# EAGLE schematic Escorna_Shield_botoneira_2_0B (EAGLE 6.4)
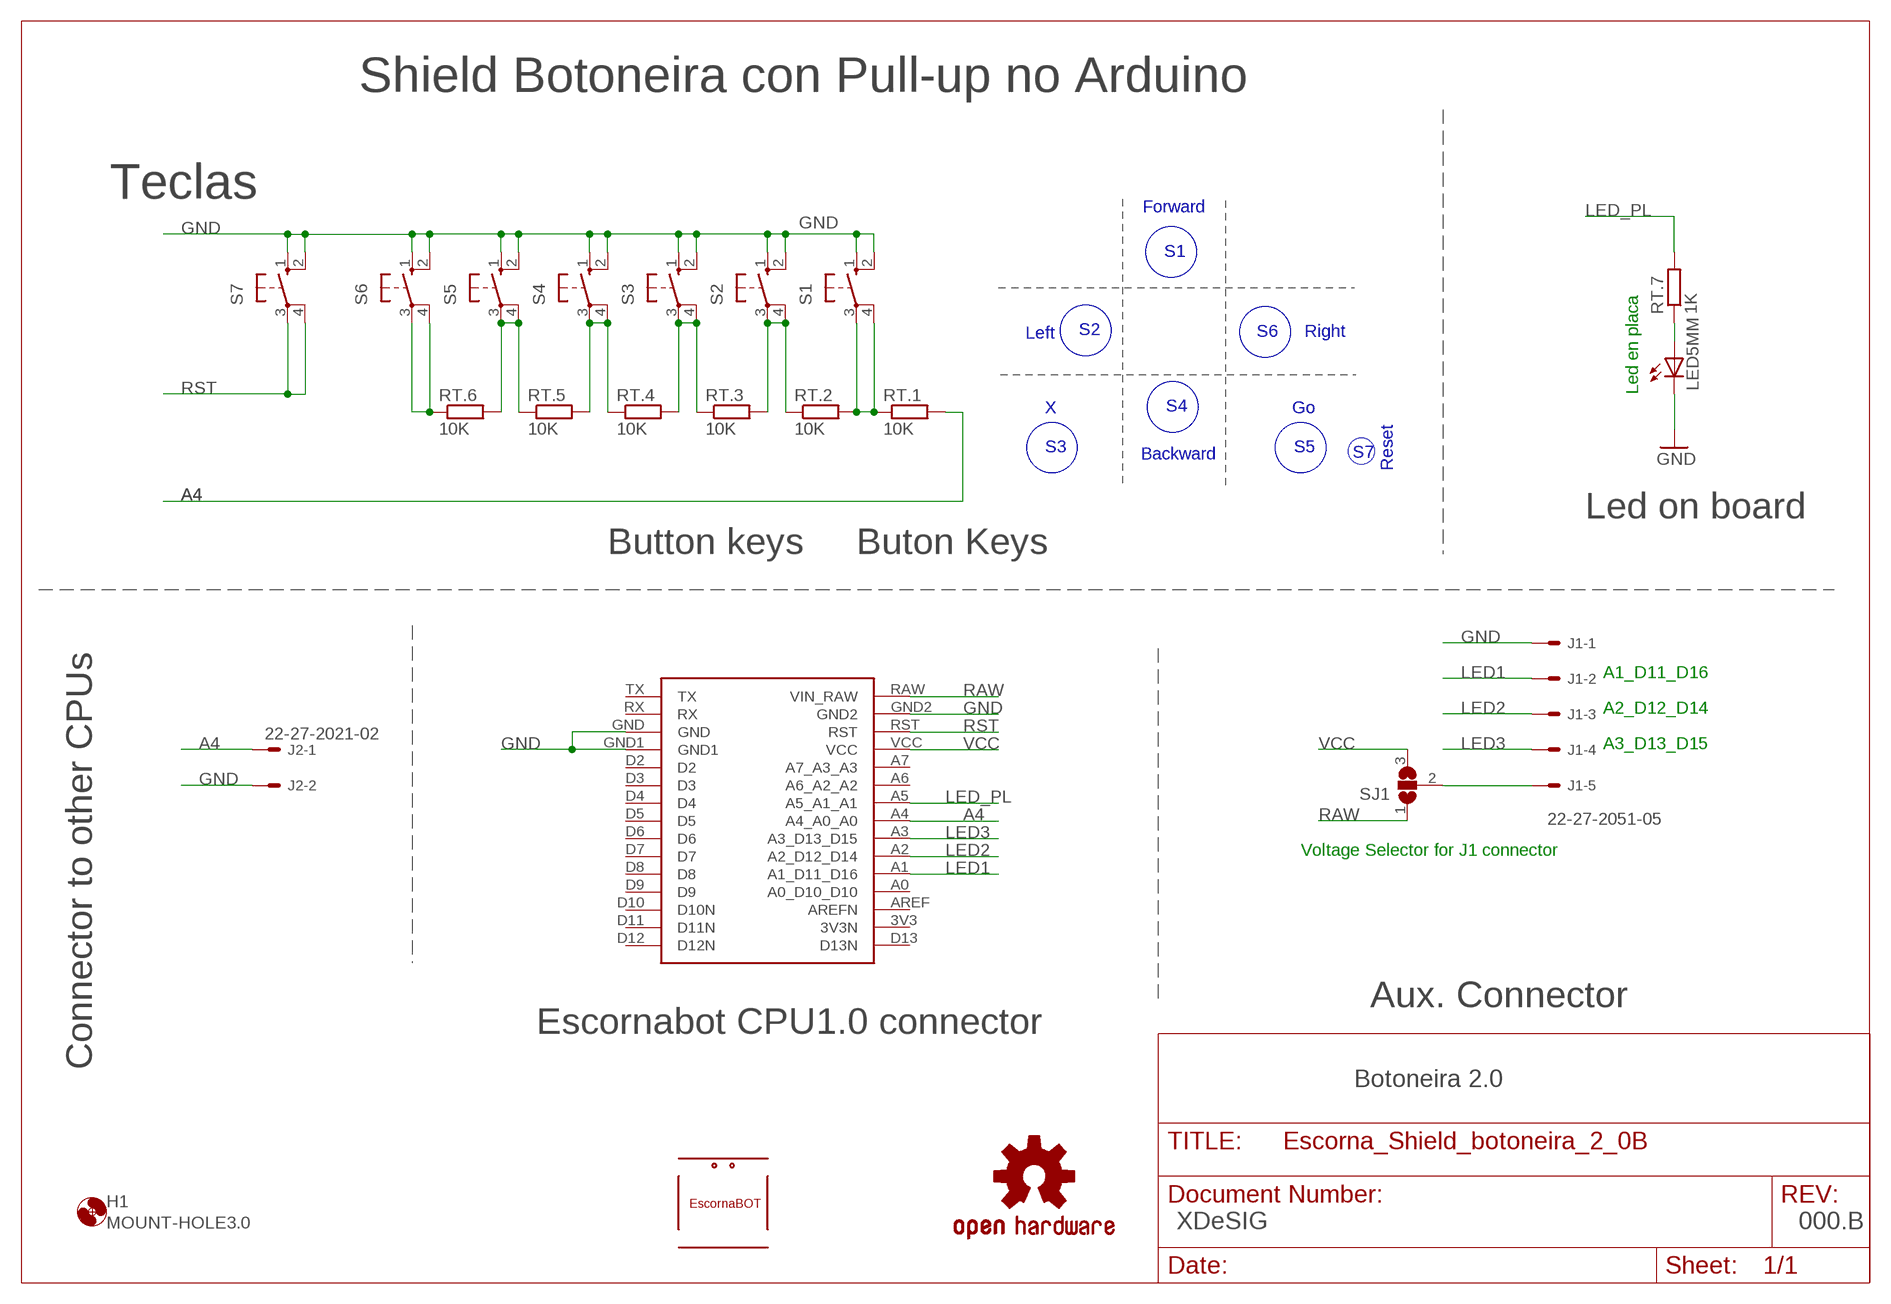
[diagram p0: schematic, sheet 1]

## Parts
ESSH1  OUTL_ESCORNASHILED  [OUTL_ESCORNASHIELD]
H1  MOUNT-HOLE3.0  [3,0]
J1  22-27-2051-05  [6410-05]
J2  22-27-2021-02  [6410-02]
LED5MM  LED5MM  [LED5MM]
LOGO2  OSHW-LOGOS  [OSHW-LOGO-S]
RT.1  10K  R-EU_0204/7  [0204/7]
RT.2  10K  R-EU_0204/7  [0204/7]
RT.3  10K  R-EU_0204/7  [0204/7]
RT.4  10K  R-EU_0204/7  [0204/7]
RT.5  10K  R-EU_0204/7  [0204/7]
RT.6  10K  R-EU_0204/7  [0204/7]
RT.7  1K  R-EU_0204/7  [0204/7]
S1  B3F-40XX  40-XX  [B3F40XX_NH]
S2  B3F-40XX  40-XX  [B3F40XX_NH]
S3  B3F-40XX  40-XX  [B3F40XX_NH]
S4  B3F-40XX  40-XX  [B3F40XX_NH]
S5  B3F-40XX  40-XX  [B3F40XX_NH]
S6  B3F-40XX  40-XX  [B3F40XX_NH]
S7  10-XX  [B3F-10XX]
SJ1  SOLDERJUMPER_2WAY  [SJ_2]
U$1  ESCORNABOT  [ESCORNA_PEQUE]

## Nets
A4: ESSH1.A4(A4_A0_A0) J2.1 RT.1.2
GND: ESSH1.GND ESSH1.GND1 ESSH1.GND2 J1.1 J2.2 LED5MM.K(C) S1.1(S) S1.2(S1) S2.1(S) S2.2(S1) S3.1(S) S3.2(S1) S4.1(S) S4.2(S1) S5.1(S) S5.2(S1) S6.1(S) S6.2(S1) S7.1(S) S7.2(S1)
LED1: ESSH1.A1(A1_D11_D16) J1.2
LED2: ESSH1.A2(A2_D12_D14) J1.3
LED3: ESSH1.A3(A3_D13_D15) J1.4
LED_PL: ESSH1.A5(A5_A1_A1) RT.7.2
N$1: LED5MM.A RT.7.1
N$2: J1.5 SJ1.2
N$6: RT.6.1 S6.3(P) S6.4(P1)
N$7: RT.1.1 RT.2.2 S1.3(P) S1.4(P1)
N$10: RT.2.1 RT.3.2 S2.3(P) S2.4(P1)
N$11: RT.3.1 RT.4.2 S3.3(P) S3.4(P1)
N$12: RT.4.1 RT.5.2 S4.3(P) S4.4(P1)
N$13: RT.5.1 RT.6.2 S5.3(P) S5.4(P1)
RAW: ESSH1.RAW(VIN_RAW) SJ1.1
RST: ESSH1.RST S7.3(P) S7.4(P1)
VCC: ESSH1.VCC SJ1.3
Unconnected: ESSH1.3V3(3V3N) ESSH1.A0(A0_D10_D10) ESSH1.A6(A6_A2_A2) ESSH1.A7(A7_A3_A3) ESSH1.AREF(AREFN) ESSH1.D2 ESSH1.D3 ESSH1.D4 ESSH1.D5 ESSH1.D6 ESSH1.D7 ESSH1.D8 ESSH1.D9 ESSH1.D10(D10N) ESSH1.D11(D11N) ESSH1.D12(D12N) ESSH1.D13(D13N) ESSH1.RX ESSH1.TX

## Notes on the sheet
- Shield Botoneira con Pull-up no Arduino
- Teclas
- Forward
- S1
- Left | S2 | S6 | Right
- Led en placa
- X | S4 | Go
- S3 | S5
- Backward | S7
- Reset
- Led on board
- Button keys | Buton Keys
- A1_D11_D16
- A2_D12_D14
- A3_D13_D15
- Voltage Selector for J1 connector
- Aux. Connector
- Escornabot CPU1.0 connector
- Connector to other CPUs
- Botoneira 2.0
- XDeSIG | 000.B

## Library data of the parts
ESSH1 = escorna:OUTL_ESCORNASHILED
H1 = holes:MOUNT-HOLE: MOUNTING HOLE with drill center marker
J1 = con-molex:22-?-05: CONNECTOR wire to board 2.54 mm (.1 inch) pitch header; OC_FARNELL: unknown; OC_NEWARK: unknown
J2 = con-molex:22-?-02: CONNECTOR wire to board 2.54 mm (.1 inch) pitch header; OC_FARNELL: unknown; OC_NEWARK: unknown
LED5MM = adafruit:LED: LED OSRAM: - CHIPLED LG R971, LG N971, LY N971, LG Q971, LY Q971, LO R971, LY R971 LH N974, LH R974 LS Q976, LO Q976, LY Q976 LO Q996 - Hyper CHIPLED LW Q18S LB Q993, LB Q99A, LB R99A - SideLED LS A670, LO A670, LY A670, LG A670, LP A670 LB A673, LV A673, LT A673, LW A673 LH A674 LY A675 LS A676, LA A676, LO A676, LY A676, LW A676 LS A679, LY A679, LG A679 - Hyper Micro SIDELED® LS Y876, LA Y876, LO Y876, LY Y876 LT Y87S - SmartLED LW L88C, LW L88S LB L89C, LB L89S, LG L890 LS L89K, LO L89K, LY L89K LS L896, LA L896, LO L896, LY L896 - TOPLED LS T670, LO T670, LY T670, LG T670, LP T670 LSG T670, LSP T670, LSY T670, LOP T670, LYG T670 LG T671, LOG T671, LSG T671 LB T673, LV T673, LT T673, LW T673 LH T674 LS T676, LA T676, LO T676, LY T676, LB T676, LH T676, LSB T676, LW T676 LB T67C, LV T67C, LT T67C, LS T67K, LO T67K, LY T67K, LW E67C LS E67B, LA E67B, LO E67B, LY E67B, LB E67C, LV E67C, LT E67C LW T67C LS T679, LY T679, LG T679 LS T770, LO T770, LY T770, LG T770, LP T770 LB T773, LV T773, LT T773, LW T773 LH T774 LS E675, LA E675, LY E675, LS T675 LS T776, LA T776, LO T776, LY T776, LB T776 LHGB T686 LT T68C, LB T68C - Hyper Mini TOPLED® LB M676 - Mini TOPLED Santana® LG M470 LS M47K, LO M47K, LY M47K Source: http://www.osram.convergy.de/
LOGO2 = SparkFun-Aesthetics:OSHW-LOGO: Open Source Hardware Logo This logo indicates the piece of hardware it is found on incorporates a OSHW license and/or adheres to the definition of open source hardware found here: http://freedomdefined.org/OSHW
RT.1-RT.7 = rcl:R-EU_: RESISTOR, European symbol
S1-S6 = switch-omron:40-XX: OMRON SWITCH
S7 = switch-omron:10-XX: OMRON SWITCH; MPN: B3F-1000; OC_FARNELL: 176432; OC_NEWARK: 36M3542
SJ1 = SparkFunEagle-6-6-07:SOLDERJUMPER_2WAY: Solder Jumper 2 way solder jumper
U$1 = escorna:ESCORNABOT